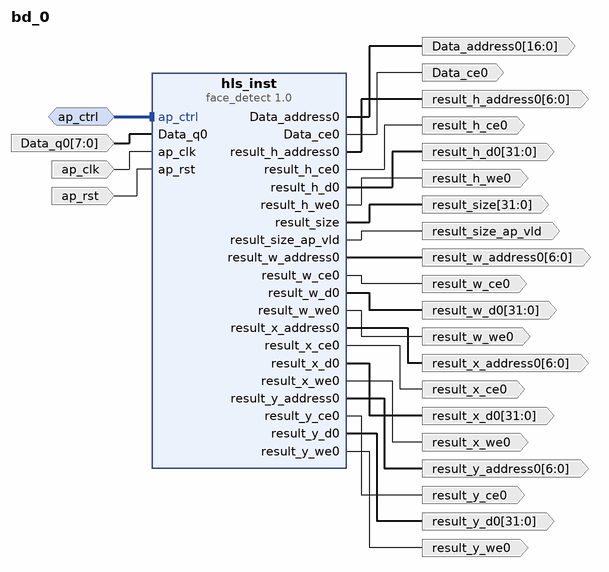
[diagram p0: block diagram of the top level]
# Vivado block design bd_0, xc7z020clg400-1, Vivado 2023.2
create_bd_design bd_0

create_bd_intf_port -mode Slave -vlnv xilinx.com:interface:acc_handshake_rtl:1.0 ap_ctrl
create_bd_port -dir O -from 16 -to 0 -type data Data_address0
create_bd_port -dir O Data_ce0
create_bd_port -dir I -from 7 -to 0 -type data Data_q0
create_bd_port -dir I -type clk ap_clk
set_property -dict {CONFIG.FREQ_HZ 200000000.0} [get_bd_ports ap_clk]
create_bd_port -dir I -type rst ap_rst
set_property -dict {CONFIG.POLARITY ACTIVE_HIGH} [get_bd_ports ap_rst]
create_bd_port -dir O -from 6 -to 0 -type data result_h_address0
create_bd_port -dir O result_h_ce0
create_bd_port -dir O -from 31 -to 0 -type data result_h_d0
create_bd_port -dir O result_h_we0
create_bd_port -dir O -from 31 -to 0 -type data result_size
create_bd_port -dir O result_size_ap_vld
create_bd_port -dir O -from 6 -to 0 -type data result_w_address0
create_bd_port -dir O result_w_ce0
create_bd_port -dir O -from 31 -to 0 -type data result_w_d0
create_bd_port -dir O result_w_we0
create_bd_port -dir O -from 6 -to 0 -type data result_x_address0
create_bd_port -dir O result_x_ce0
create_bd_port -dir O -from 31 -to 0 -type data result_x_d0
create_bd_port -dir O result_x_we0
create_bd_port -dir O -from 6 -to 0 -type data result_y_address0
create_bd_port -dir O result_y_ce0
create_bd_port -dir O -from 31 -to 0 -type data result_y_d0
create_bd_port -dir O result_y_we0

create_bd_cell -type ip -vlnv xilinx.com:hls:face_detect:1.0 hls_inst

# ---- connections ----

connect_bd_intf_net -intf_net ap_ctrl_0_1 [get_bd_intf_ports ap_ctrl] [get_bd_intf_pins hls_inst/ap_ctrl]
connect_bd_net -net Data_q0_0_1 [get_bd_ports Data_q0] [get_bd_pins hls_inst/Data_q0]
connect_bd_net -net ap_clk_0_1 [get_bd_ports ap_clk] [get_bd_pins hls_inst/ap_clk]
connect_bd_net -net ap_rst_0_1 [get_bd_ports ap_rst] [get_bd_pins hls_inst/ap_rst]
connect_bd_net [get_bd_pins hls_inst/Data_address0] [get_bd_ports Data_address0]
connect_bd_net [get_bd_pins hls_inst/Data_ce0] [get_bd_ports Data_ce0]
connect_bd_net [get_bd_pins hls_inst/result_h_address0] [get_bd_ports result_h_address0]
connect_bd_net [get_bd_pins hls_inst/result_h_ce0] [get_bd_ports result_h_ce0]
connect_bd_net [get_bd_pins hls_inst/result_h_d0] [get_bd_ports result_h_d0]
connect_bd_net [get_bd_pins hls_inst/result_h_we0] [get_bd_ports result_h_we0]
connect_bd_net [get_bd_pins hls_inst/result_size] [get_bd_ports result_size]
connect_bd_net [get_bd_pins hls_inst/result_size_ap_vld] [get_bd_ports result_size_ap_vld]
connect_bd_net [get_bd_pins hls_inst/result_w_address0] [get_bd_ports result_w_address0]
connect_bd_net [get_bd_pins hls_inst/result_w_ce0] [get_bd_ports result_w_ce0]
connect_bd_net [get_bd_pins hls_inst/result_w_d0] [get_bd_ports result_w_d0]
connect_bd_net [get_bd_pins hls_inst/result_w_we0] [get_bd_ports result_w_we0]
connect_bd_net [get_bd_pins hls_inst/result_x_address0] [get_bd_ports result_x_address0]
connect_bd_net [get_bd_pins hls_inst/result_x_ce0] [get_bd_ports result_x_ce0]
connect_bd_net [get_bd_pins hls_inst/result_x_d0] [get_bd_ports result_x_d0]
connect_bd_net [get_bd_pins hls_inst/result_x_we0] [get_bd_ports result_x_we0]
connect_bd_net [get_bd_pins hls_inst/result_y_address0] [get_bd_ports result_y_address0]
connect_bd_net [get_bd_pins hls_inst/result_y_ce0] [get_bd_ports result_y_ce0]
connect_bd_net [get_bd_pins hls_inst/result_y_d0] [get_bd_ports result_y_d0]
connect_bd_net [get_bd_pins hls_inst/result_y_we0] [get_bd_ports result_y_we0]

validate_bd_design
save_bd_design
